# Altium schematic sheet ISL6236A_DEMO.SchDoc
size A3; SheetNumber: 1; SheetTotal: 1
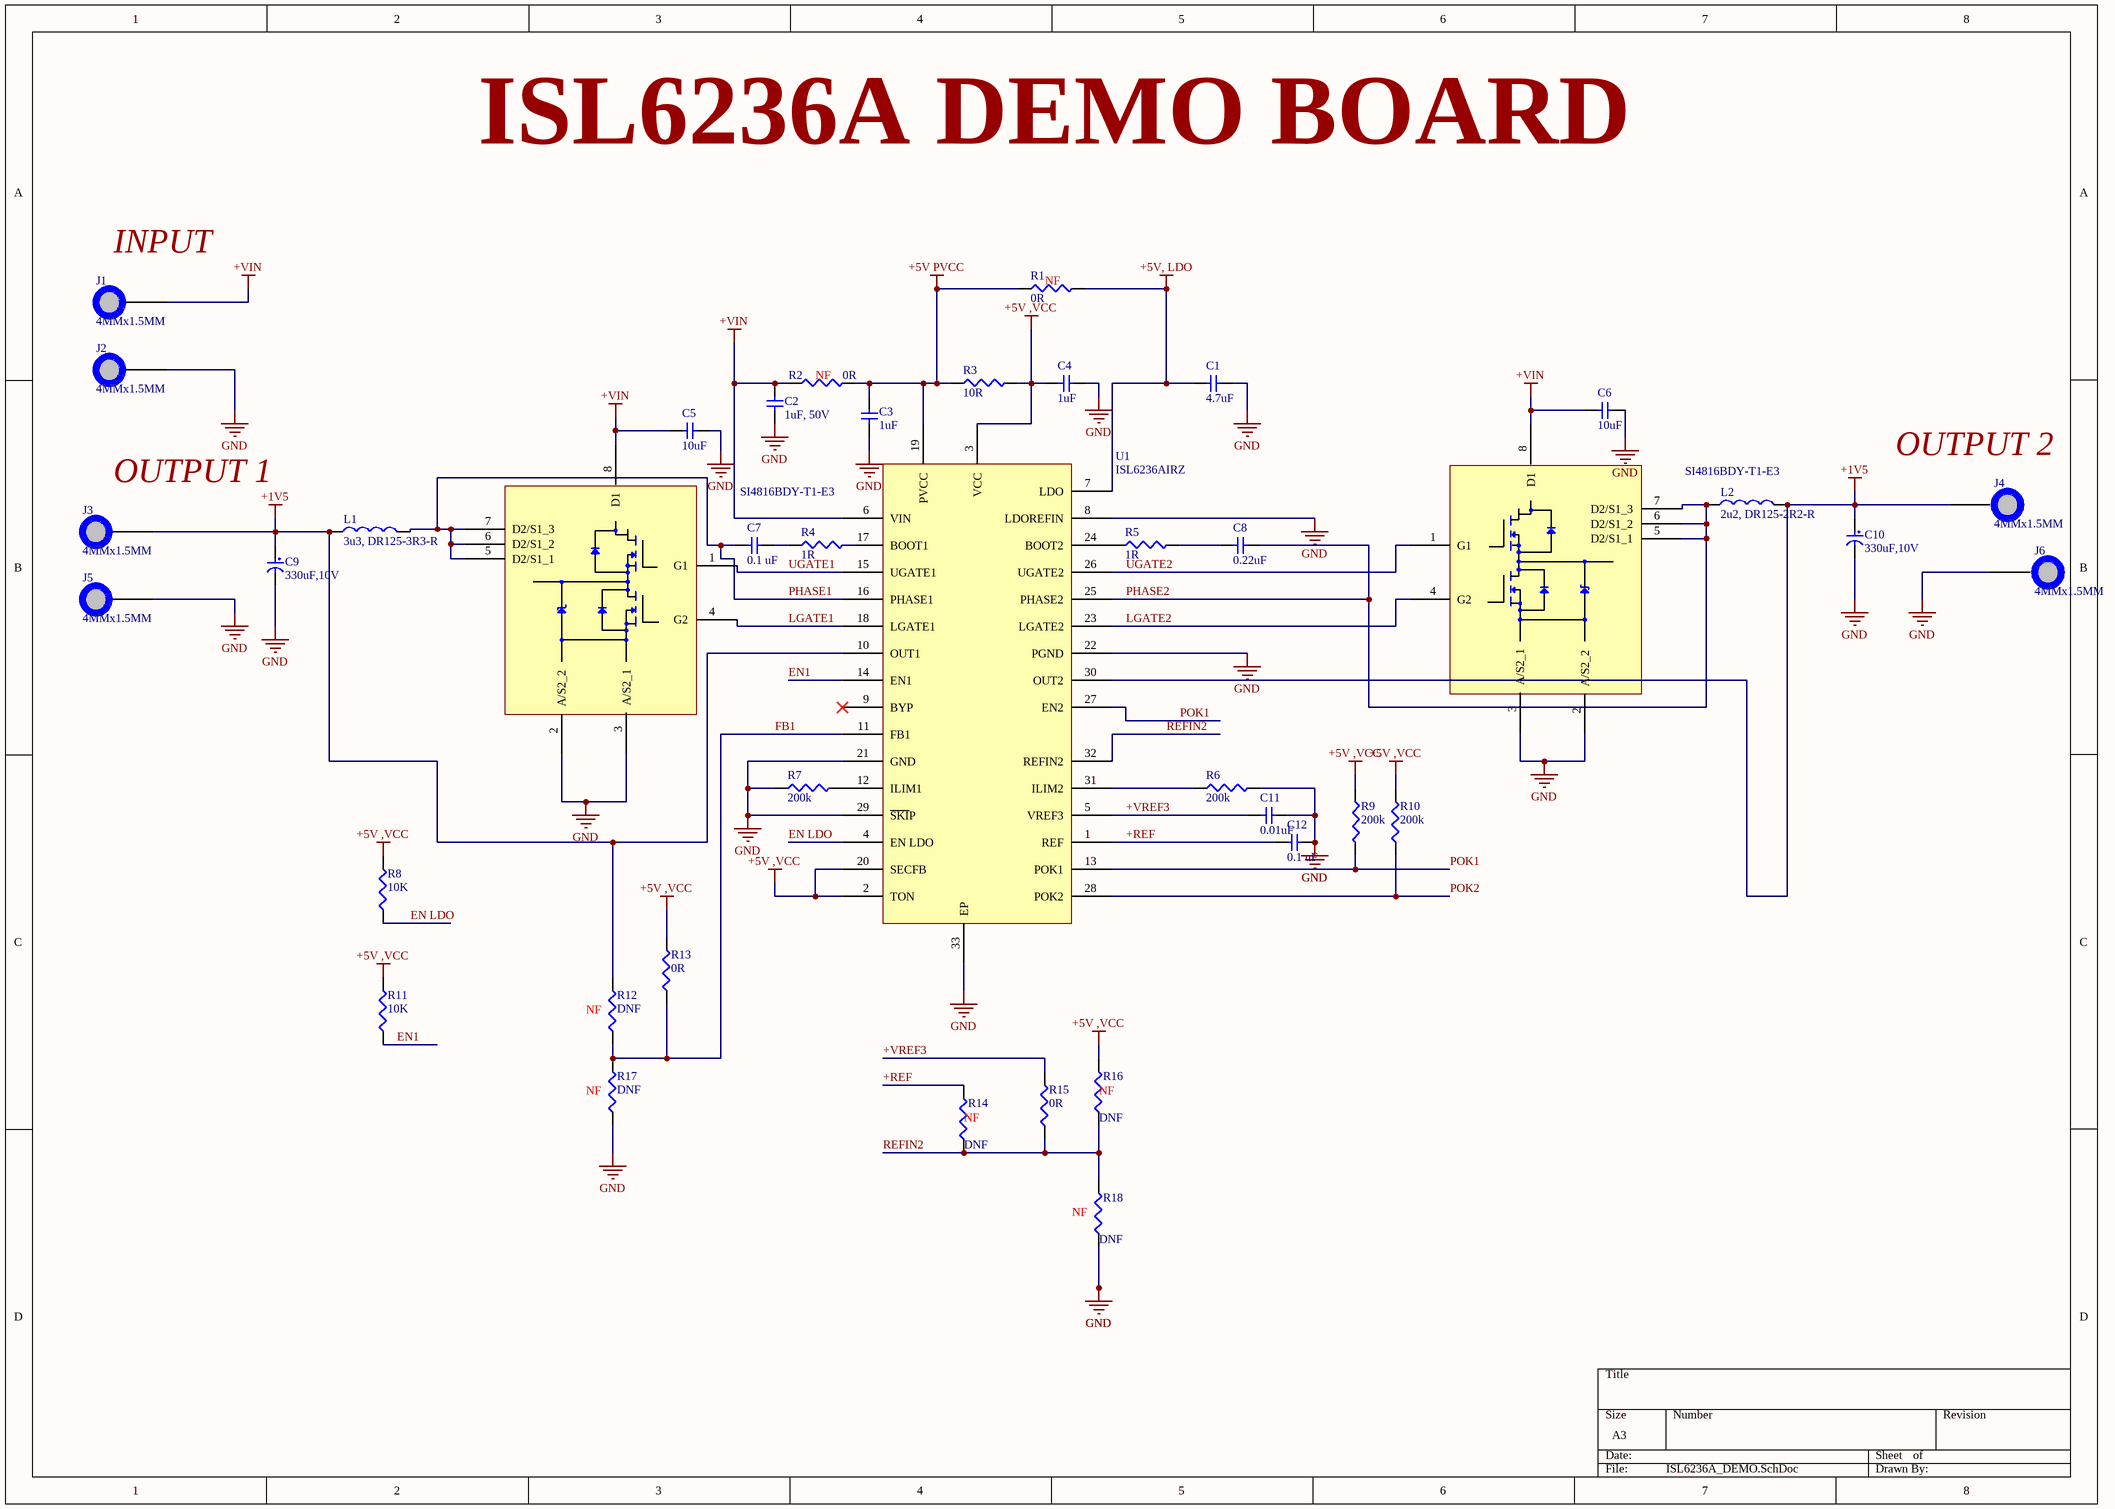
[diagram p0: ISL6236A_DEMO.SchDoc]

## Parts
C1  4.7uF  [C1206]
C2  1uF, 50V  [C0805]
C3  1uF  [C0805]
C4  1uF  [C0805]
C5  10uF  [C1210]
C6  10uF  [C1210]
C7  0.1 uF  [C0805]
C8  0.22uF  [C0805]
C9  330uF,10V  [7343-43]
C10  330uF,10V  [7343-43]
C11  0.01uF  [C0805]
C12  0.1 uF  [C0805]
J1  4MMx1.5MM  [PAD_WITH_HOLE_4MMx1MM5]
J2  4MMx1.5MM  [PAD_WITH_HOLE_4MMx1MM5]
J3  4MMx1.5MM  [PAD_WITH_HOLE_4MMx1MM5]
J4  4MMx1.5MM  [PAD_WITH_HOLE_4MMx1MM5]
J5  4MMx1.5MM  [PAD_WITH_HOLE_4MMx1MM5]
J6  4MMx1.5MM  [PAD_WITH_HOLE_4MMx1MM5]
L1  3u3, DR125-3R3-R  [DR125]
L2  2u2, DR125-2R2-R  [DR125]
Q1  SI4816BDY-T1-E3  [SO-8]
Q2  SI4816BDY-T1-E3  [SO-8]
R1  0R  [R0805]
R2  0R  [R0805]
R3  10R  [R0805]
R4  1R  [R0805]
R5  1R  [R0805]
R6  200k  [R0805]
R7  200k  [R0805]
R8  10K  [R0805]
R9  200k  [R0805]
R10  200k  [R0805]
R11  10K  [R0805]
R12  DNF  [R0805]
R13  0R  [R0805]
R14  DNF  [R0805]
R15  0R  [R0805]
R16  DNF  [R0805]
R17  DNF  [R0805]
R18  DNF  [R0805]
U1  ISL6236AIRZ  [L32.5x5B]

## Nets
+1V5: C9.1 C10.1 J3.1 J4.1 L1.1 L2.2 R12.2 U1.10(OUT1) U1.30(OUT2)
+5V ,VCC: C4.1 R3.2 R8.2 R9.1 R10.2 R11.2 R13.2 R16.2 U1.2(TON) U1.3(VCC) U1.20(SECFB)
+5V PVCC: C3.2 R1.1 R2.2 R3.1 U1.19(PVCC)
+5V, LDO: C1.1 R1.2 U1.7(LDO)
+VIN: C2.1 C5.2 C6.2 J1.1 Q1.8(D1) Q2.8(D1) R2.1 U1.6(VIN)
GND: C1.2 C2.2 C3.1 C4.2 C5.1 C6.1 C9.2 C10.2 C11.2 C12.2 J2.1 J5.1 J6.1 Q1.2(A/S2_2) Q1.3(A/S2_1) Q2.2(A/S2_2) Q2.3(A/S2_1) R6.2 R7.1 R17.1 R18.1 U1.8(LDOREFIN) U1.21(GND) U1.22(PGND) U1.29(~{SKI}P) U1.33(EP)
+REF: C12.1 R14.2 U1.1(REF)
+VREF3: C11.1 R15.2 U1.5(VREF3)
EN1: R11.1 U1.14(EN1)
EN LDO: R8.1 U1.4(EN_LDO)
FB1: R12.1 R13.1 R17.2 U1.11(FB1)
LGATE1: Q1.4(G2) U1.18(LGATE1)
LGATE2: Q2.4(G2) U1.23(LGATE2)
PHASE1: C7.1 L1.2 Q1.5(D2/S1_1) Q1.6(D2/S1_2) Q1.7(D2/S1_3) U1.16(PHASE1)
PHASE2: C8.2 L2.1 Q2.5(D2/S1_1) Q2.6(D2/S1_2) Q2.7(D2/S1_3) U1.25(PHASE2)
POK1: R9.2 U1.13(POK1) U1.27(EN2)
POK2: R10.1 U1.28(POK2)
REFIN2: R14.1 R15.1 R16.1 R18.2 U1.32(REFIN2)
UGATE1: Q1.1(G1) U1.15(UGATE1)
UGATE2: Q2.1(G1) U1.26(UGATE2)
NetC7_2: C7.2 R4.1
NetC8_1: C8.1 R5.2
NetR4_2: R4.2 U1.17(BOOT1)
NetR5_1: R5.1 U1.24(BOOT2)
NetR6_1: R6.1 U1.31(ILIM2)
NetR7_2: R7.2 U1.12(ILIM1)

Not connected (* = marked no-connect by the designer): U1 9(BYP)*

## Notes on the sheet
- ISL6236A DEMO BOARD
- (near J1) INPUT
- (near R1) NF
- (near R2) NF
- (near J3) OUTPUT 1
- (near J4) OUTPUT 2
- (near R12) NF
- (near R17) NF
- (near R14) NF
- (near R16) NF
- (near R18) NF

## Library data of the parts
C1 = C3216X5R1H475K160AB: C Series 1206 4.7 uF 50 V ±10 % Tolerance X5R SMT Multilayer Ceramic Capacitor; Manufacturer: TDK; Supplier: Digi-Key; Supplier Part Number: 445-5994-2-ND; Manufacturer Part Number: C3216X5R1H475K160AB; RoHS: Yes; Category: Ceramic Capacitors; Stock: 64000; Pricing: 2000=0,22725, 4000=0,2121, 10000=0,20453, 14000=0,2015, 50000=0,19316 (USD); ComponentLink1URL: https://datasheet.ciiva.com/24216/c3216x5r1h475k160ab-265269-24216325.pdf?src-supplier=Mouser; ComponentLink1Description: https://datasheet.ciiva.com/24216/c3216x5r1h475k160ab-265269-24216325.pdf?src-supplier=Mouser; ComponentLink2URL: https://datasheet.ciiva.com/6286/tdkmlcccaprange-6286230.pdf?src-supplier=Digi-Key; ComponentLink2Description: https://datasheet.ciiva.com/6286/tdkmlcccaprange-6286230.pdf?src-supplier=Digi-Key; ComponentLink3URL: https://datasheet.ciiva.com/6286/tdkmlcccaprange-6286233.pdf?src-supplier=Digi-Key; ComponentLink3Description: https://datasheet.ciiva.com/6286/tdkmlcccaprange-6286233.pdf?src-supplier=Digi-Key; ComponentLink4URL: https://datasheet.ciiva.com/6286/tdkmlcccaprange-6286236.pdf?src-supplier=Digi-Key; ComponentLink4Description: https://datasheet.ciiva.com/6286/tdkmlcccaprange-6286236.pdf?src-supplier=Digi-Key
C2 = C0805X105K5RACAUTO: Ceramic Capacitor, Multilayer, Ceramic, 50V, 10% +Tol, 10% -Tol, X7R, 15% TC, 1uF, Surface Mount, 0805; Manufacturer: KEMET; Supplier: Digi-Key; Supplier Part Number: 399-C0805X105K5RACAUTOCT-ND; Manufacturer Part Number: C0805X105K5RACAUTO; RoHS: No; Category: Ceramic Capacitors; Stock: 697; Pricing: 1=0,97, 10=0,736, 50=0,6118, 100=0,5268, 500=0,4078, 1000=0,35117 (USD)
C3 C4 = 08053D105KAT2A\3K: Cap Cer 1UF 25V X5R 0805; Manufacturer: Kyocera AVX; Supplier: Digi-Key; Supplier Part Number: 478-KGM21AR51E105KUCT-ND; RoHS: No; Category: Ceramic Capacitors; Stock: 27624; Pricing: 1=0,41, 10=0,288, 50=0,2016, 100=0,1728, 500=0,1296, 1000=0,10944 (USD); Manufacturer Part Number: 08053D105KAT2A\3K
C5 C6 = C1210C106K5PAC7210: Cap Ceramic 10uF 50V X5R 10% Pad SMD 1210 85C T/R; Manufacturer: KEMET; Supplier: Digi-Key; Supplier Part Number: 399-C1210C106K5PAC7210CT-ND; Manufacturer Part Number: C1210C106K5PAC7210; RoHS: Yes; Category: Ceramic Capacitors; Stock: 38264; Pricing: 1=0,9, 10=0,686, 50=0,5702, 100=0,491, 500=0,38016, 1000=0,32736 (USD)
C7 C12 = C0805C104K5RAC7800: Multilayer Ceramic Capacitor, 0.1 uF, 50 V, ± 10%, X7R, 0805 [2012 Metric]; Manufacturer: KEMET; Supplier: Digi-Key; Supplier Part Number: 399-C0805C104K5RAC7800DKR-ND; RoHS: No; Stock: 2423632; Pricing: 1=0,13, 10=0,092, 50=0,052, 100=0,0431, 500=0,03024, 1000=0,02504 (USD); ComponentLink1URL: https://datasheet.octopart.com/C0805C104K5RACTU-KEMET-datasheet-101576148.pdf?src-supplier=Farnell; ComponentLink1Description: https://datasheet.octopart.com/C0805C104K5RACTU-KEMET-datasheet-101576148.pdf?src-supplier=Farnell; ComponentLink2URL: https://datasheet.octopart.com/C0805C104K5RAC-TU-Kemet-datasheet-32036385.pdf?src-supplier=Element14; ComponentLink2Description: https://datasheet.octopart.com/C0805C104K5RAC-TU-Kemet-datasheet-32036385.pdf?src-supplier=Element14; ComponentLink3URL: https://datasheet.octopart.com/C0805C104K5RAC-TU-Kemet-datasheet-5313890.pdf?src-supplier=Newark; ComponentLink3Description: https://datasheet.octopart.com/C0805C104K5RAC-TU-Kemet-datasheet-5313890.pdf?src-supplier=Newark; ComponentLink4URL: https://datasheet.octopart.com/C0805C104K5RACTU-KEMET-datasheet-164512540.pdf?src-supplier=TME; ComponentLink4Description: https://datasheet.octopart.com/C0805C104K5RACTU-KEMET-datasheet-164512540.pdf?src-supplier=TME; Manufacturer Part Number: C0805C104K5RAC7800
C8 = C0805C224K5RACTU: Multilayer Ceramic Capacitor, 0.22 uF, 50 V, ± 10%, X7R, 0805 [2012 Metric]; Manufacturer: KEMET; Value: 220nF; Voltage Rating: 50V; Dissipation Factor: 2.5%; Supplier: Digi-Key; Supplier Part Number: 399-C0805C224K5RACTUCT-ND; Manufacturer Part Number: C0805C224K5RACTU; RoHS: Yes; Category: Ceramic Capacitors; Stock: 1003081; Pricing: 1=0,15, 10=0,106, 50=0,06, 100=0,0497, 500=0,03484, 1000=0,02885 (USD); Mounting Technology: Surface Mount,PCB; Case/Package: 0805; Case Code (Metric): 2012; Case Code (Imperial): 0805; Dielectric Material: Ceramic; Min Operating Temperature: -55°C; Max Operating Temperature: 125°C; Package Quantity: 4000; Tolerance: 10%; Packaging: Tape and Reel; Voltage Rating (DC): 50V; Dielectric: X7R; Termination: SMD/SMT; Voltage: 50V; Series: SMD Comm X7R; Construction: Flat; Length: 2mm; Width: 1.2mm; Height: 1.1mm; Lead Pitch: 0.75mm; Depth: 1.25mm; Radiation Hardening: No; Reach SVHC Compliant: No; RoHS Compliant: Yes; ComponentLink1URL: https://datasheet.ciiva.com/7842/kem-c1002-x7r-smd-7842582.pdf?src-supplier=Element14; ComponentLink1Description: https://datasheet.ciiva.com/7842/kem-c1002-x7r-smd-7842582.pdf?src-supplier=Element14; ComponentLink2URL: https://datasheet.ciiva.com/28682/1851736-28682316.pdf?src-supplier=Element14; ComponentLink2Description: https://datasheet.ciiva.com/28682/1851736-28682316.pdf?src-supplier=Element14; ComponentLink3URL: https://datasheet.ciiva.com/14589/70095383-14589519.pdf?src-supplier=Allied+Electronics; ComponentLink3Description: https://datasheet.ciiva.com/14589/70095383-14589519.pdf?src-supplier=Allied+Electronics; ComponentLink4URL: https://datasheet.ciiva.com/14603/70095383-14603247.pdf?src-supplier=Allied+Electronics; ComponentLink4Description: https://datasheet.ciiva.com/14603/70095383-14603247.pdf?src-supplier=Allied+Electronics
C9 C10 = T530X337M010ATE004: Cap Tant Solid 330uF 10V X CASE 20% (7.3 X 4.3 X 4mm) SMD 7343-43 0.004 Ohm 125 C T/R; Manufacturer: KEMET; Supplier: Digi-Key; Supplier Part Number: 399-10378-1-ND; Manufacturer Part Number: T530X337M010ATE004; RoHS: Yes; Category: Polymer Capacitors; Stock: 3821; Pricing: 1=7,14, 10=6,35, 50=5,5562, 100=5,0799 (USD); ComponentLink1URL: https://datasheet.ciiva.com/11794/0900766b80deaa91-11794477.pdf?src-supplier=Rs; ComponentLink1Description: https://datasheet.ciiva.com/11794/0900766b80deaa91-11794477.pdf?src-supplier=Rs; ComponentLink2URL: https://datasheet.ciiva.com/14593/70096008-14593753.pdf?src-supplier=Allied+Electronics; ComponentLink2Description: https://datasheet.ciiva.com/14593/70096008-14593753.pdf?src-supplier=Allied+Electronics
C11 = C0805F103K5RACTU: 0805 C 10nF Ceramic Multilayer Capacitor; 50 VDC; +125degC; X7R Dielec; +/-10%; Manufacturer: KEMET; Voltage Rating: 50V; Tolerance: 10%; Supplier: Digi-Key; Supplier Part Number: 399-C0805F103K5RAC7800CT-ND; Manufacturer Part Number: C0805F103K5RACTU; RoHS: Yes; Category: Ceramic Capacitors; Stock: 11337; Pricing: 1=0,33, 10=0,225, 50=0,1502, 100=0,1276, 500=0,09008, 1000=0,07883 (USD); Mounting Technology: Surface Mount; Case/Package: 0805; Pins: 2; Case Code (Imperial): 0805; Case Code (Metric): 2012; Min Operating Temperature: -55°C; Max Operating Temperature: 125°C; Value: 10nF; Package Quantity: 1; Voltage Rating (DC): 50V; Packaging: Cut Tape; Dielectric: X7R; Termination: SMD/SMT; Series: FO-CAP; Construction: Flat; Length: 2mm; Width: 0.049inch; Height: 0.9mm; Lead Pitch: 0.75mm; Thickness: 0.039inch; Depth: 1.25mm; Reach SVHC Compliant: No; RoHS Compliant: Yes; ComponentLink1URL: https://datasheet.ciiva.com/146/docfinderpartnumber-c0805f103k5ractu-146278.pdf?src-supplier=Digi-Key; ComponentLink1Description: https://datasheet.ciiva.com/146/docfinderpartnumber-c0805f103k5ractu-146278.pdf?src-supplier=Digi-Key; ComponentLink2URL: https://datasheet.ciiva.com/7842/48829-7842407.pdf?src-supplier=Element14; ComponentLink2Description: https://datasheet.ciiva.com/7842/48829-7842407.pdf?src-supplier=Element14; ComponentLink3URL: https://datasheet.ciiva.com/7842/48829-7842408.pdf?src-supplier=Element14; ComponentLink3Description: https://datasheet.ciiva.com/7842/48829-7842408.pdf?src-supplier=Element14
J1-J6 = PAD_WITH_HOLE_4MMx1MM5: Pad with a hole 4mmx1.5mm
L1 = DR125-3R3-R: Inductor Power Shielded Drum Core 3.3uH 20% 100KHz Ferrite 9.26A 6.3mOhm DCR T/R; Manufacturer: Eaton Cooper; Supplier: Digi-Key; Supplier Part Number: 513-1529-2-ND; Manufacturer Part Number: DR125-3R3-R; RoHS: Yes; Category: Fixed Inductors; Stock: 28200; Pricing: 600=0,63625, 1200=0,56555, 3000=0,54788, 6000=0,53021, 15000=0,51253 (USD)
L2 = DR125-2R2-R: Ind Power Shielded Wirewound 2.2uH 20% 100KHz Ferrite 10.9A T/R; Manufacturer: Eaton Cooper; Supplier: Digi-Key; Supplier Part Number: 513-1662-2-ND; Manufacturer Part Number: DR125-2R2-R; RoHS: Yes; Category: Fixed Inductors; Stock: 1800; Pricing: 600=0,6363, 1200=0,5656, 3000=0,54793, 6000=0,53025, 15000=0,51257 (USD); ComponentLink1URL: https://datasheet.ciiva.com/14667/0900766b8116a153-14667792.pdf?src-supplier=Rs; ComponentLink1Description: https://datasheet.ciiva.com/14667/0900766b8116a153-14667792.pdf?src-supplier=Rs; ComponentLink2URL: https://datasheet.ciiva.com/26926/getdatasheetpartid-571249-26926912.pdf?src-supplier=Verical; ComponentLink2Description: https://datasheet.ciiva.com/26926/getdatasheetpartid-571249-26926912.pdf?src-supplier=Verical; ComponentLink3URL: https://datasheet.ciiva.com/8004/87246-8004874.pdf?src-supplier=Element14; ComponentLink3Description: https://datasheet.ciiva.com/8004/87246-8004874.pdf?src-supplier=Element14
Q1 Q2 = SI4816BDY-T1-E3: Trans Mosfet N-ch 30V 5.8A/8.2A 8-PIN SOIC N T/r; Manufacturer: Vishay Siliconix; Supplier: Digi-Key; Supplier Part Number: SI4816BDY-T1-E3CT-ND; RoHS: Yes; Category: MOSFETs; Pricing: 1=1,58, 10=1,419, 100=1,1402, 500=0,93678, 1000=0,77618 (USD); ComponentLink1URL: https://datasheet.ciiva.com/15137/getdatasheetpartid-99188-15137841.pdf?src-supplier=Verical; ComponentLink1Description: https://datasheet.ciiva.com/15137/getdatasheetpartid-99188-15137841.pdf?src-supplier=Verical; ComponentLink2URL: https://datasheet.ciiva.com/7710/si4816bd-7710449.pdf?src-supplier=Element14; ComponentLink2Description: https://datasheet.ciiva.com/7710/si4816bd-7710449.pdf?src-supplier=Element14; ComponentLink3URL: https://datasheet.ciiva.com/928/si4816bd-928458.pdf?src-supplier=Digi-Key; ComponentLink3Description: https://datasheet.ciiva.com/928/si4816bd-928458.pdf?src-supplier=Digi-Key; ComponentLink4URL: https://datasheet.ciiva.com/928/si4816bd-928459.pdf?src-supplier=Digi-Key; ComponentLink4Description: https://datasheet.ciiva.com/928/si4816bd-928459.pdf?src-supplier=Digi-Key; ComponentLink5URL: https://datasheet.ciiva.com/928/si4816bd-928460.pdf?src-supplier=Digi-Key; ComponentLink5Description: https://datasheet.ciiva.com/928/si4816bd-928460.pdf?src-supplier=Digi-Key; ComponentLink6URL: https://datasheet.ciiva.com/11161/si4816bd-11161496.pdf?src-supplier=Avnet; ComponentLink6Description: https://datasheet.ciiva.com/11161/si4816bd-11161496.pdf?src-supplier=Avnet; ComponentLink7URL: https://datasheet.ciiva.com/16486/si4816bd-16486349.pdf?src-supplier=Future+Electronics; ComponentLink7Description: https://datasheet.ciiva.com/16486/si4816bd-16486349.pdf?src-supplier=Future+Electronics; ComponentLink8URL: https://datasheet.ciiva.com/18448/70026226-18448822.pdf?src-supplier=Allied+Electronics; ComponentLink8Description: https://datasheet.ciiva.com/18448/70026226-18448822.pdf?src-supplier=Allied+Electronics; Manufacturer Part Number: SI4816BDY-T1-E3
R1 R2 R13 R15 = AC0805JR-070RL: Fixed Resistor, Metal Glaze/thick Film, 0.125W, 0ohm, Surface Mount, 0805; Manufacturer: Yageo; Power Rating: 125mW; Tolerance: 5%; Voltage Rating: 150V; Temperature Coefficient: 200ppm/°C; Supplier: Digi-Key; Supplier Part Number: YAG3755CT-ND; Manufacturer Part Number: AC0805JR-070RL; RoHS: Yes; Category: Chip SMD Resistors; Stock: 181915; Pricing: 1=0,1, 10=0,037, 25=0,0272, 50=0,0206, 100=0,0152, 250=0,0116, 500=0,00928, 1000=0,00683 (USD); Case/Package: 0805; Case Code (Imperial): 0805; Case Code (Metric): 2012; Min Operating Temperature: -55°C; Max Operating Temperature: 155°C; Packaging: Tape and Reel; Value: 0R; Termination: SMD/SMT; Number of Terminations: 2; Max Power Dissipation: 125mW; Features: Moisture Resistant,Automotive AEC-Q200; Series: AC; Length: 0.079inch; Width: 1.25mm; Height: 0.024inch; Lead Free: Lead Free; RoHS Compliant: Yes; ComponentLink1URL: https://datasheet.octopart.com/AC0805JR-070RL-Yageo-datasheet-166720450.pdf?src-supplier=Future+Electronics; ComponentLink1Description: https://datasheet.octopart.com/AC0805JR-070RL-Yageo-datasheet-166720450.pdf?src-supplier=Future+Electronics; ComponentLink2URL: http://www.yageo.com/documents/recent/PYu-AC_51_RoHS_L_2.pdf?src-supplier=Mouser; ComponentLink2Description: http://www.yageo.com/documents/recent/PYu-AC_51_RoHS_L_2.pdf?src-supplier=Mouser
R3 = AC0805FR-0710RL: Res Thick Film 0805 10 Ohm 1% 0.125W(1/8W) ±200ppm/C Pad SMD Automotive T/R; Manufacturer: Yageo; Supplier: Digi-Key; Supplier Part Number: YAG3690CT-ND; Manufacturer Part Number: AC0805FR-0710RL; RoHS: Yes; Category: Chip SMD Resistors; Stock: 256584; Pricing: 1=0,1, 10=0,049, 50=0,032, 100=0,0272, 500=0,01914, 1000=0,01668 (USD); ComponentLink1URL: http://www.mouser.com/ds/2/447/yageodocoutput-1111992.pdf?src-supplier=Mouser; ComponentLink1Description: http://www.mouser.com/ds/2/447/yageodocoutput-1111992.pdf?src-supplier=Mouser; ComponentLink2URL: http://www.yageo.com/NewPortal/yageodocoutput?fileName=/pdf/R-Chip/PYu-AC_51_RoHS_L_6.pdf&src-supplier=Digi-Key; ComponentLink2Description: http://www.yageo.com/NewPortal/yageodocoutput?fileName=/pdf/R-Chip/PYu-AC_51_RoHS_L_6.pdf&src-supplier=Digi-Key; ComponentLink3URL: https://www.yageo.com/upload/media/product/productsearch/datasheet/rchip/PYu-AC_51_RoHS_L_7.pdf?src-supplier=Digi-Key; ComponentLink3Description: https://www.yageo.com/upload/media/product/productsearch/datasheet/rchip/PYu-AC_51_RoHS_L_7.pdf?src-supplier=Digi-Key
R4 R5 = AC0805FR-071RL: Res Thick Film 0805 1 Ohm 1% 0.125W(1/8W) ±200ppm/C Pad SMD Automotive T/R; Manufacturer: Yageo; Supplier: Digi-Key; Supplier Part Number: YAG3705CT-ND; Manufacturer Part Number: AC0805FR-071RL; RoHS: Yes; Category: Chip SMD Resistors; Stock: 82542; Pricing: 1=0,1, 10=0,049, 50=0,032, 100=0,0272, 500=0,01914, 1000=0,01668 (USD); ComponentLink1URL: https://datasheet.ciiva.com/12576/pyu-ac-51-rohs-l-2-12576553.pdf?src-supplier=Mouser; ComponentLink1Description: https://datasheet.ciiva.com/12576/pyu-ac-51-rohs-l-2-12576553.pdf?src-supplier=Mouser
R6 R7 R9 R10 = AC0805FR-07200KL: Res Thick Film 0805 200K Ohm 1% 0.125W(1/8W) ±100ppm/C Pad SMD Automotive T/R; Manufacturer: Yageo; Supplier: Digi-Key; Supplier Part Number: YAG3706CT-ND; Manufacturer Part Number: AC0805FR-07200KL; RoHS: Yes; Category: Chip SMD Resistors; Stock: 10502; Pricing: 1=0,1, 10=0,029, 50=0,0188, 100=0,0158, 500=0,01096, 1000=0,00948 (USD); ComponentLink1URL: http://www.mouser.com/ds/2/447/yageodocoutput-1111992.pdf?src-supplier=Mouser; ComponentLink1Description: http://www.mouser.com/ds/2/447/yageodocoutput-1111992.pdf?src-supplier=Mouser; ComponentLink2URL: http://www.yageo.com/NewPortal/yageodocoutput?fileName=/pdf/R-Chip/PYu-AC_51_RoHS_L_6.pdf&src-supplier=Digi-Key; ComponentLink2Description: http://www.yageo.com/NewPortal/yageodocoutput?fileName=/pdf/R-Chip/PYu-AC_51_RoHS_L_6.pdf&src-supplier=Digi-Key; ComponentLink3URL: http://www.yageo.com/documents/recent/PYu-AC_51_RoHS_L_2.pdf?src-supplier=Future+Electronics; ComponentLink3Description: http://www.yageo.com/documents/recent/PYu-AC_51_RoHS_L_2.pdf?src-supplier=Future+Electronics; ComponentLink4URL: https://datasheet.octopart.com/AC0805FR-07200KL-Yageo-datasheet-151884373.pdf?src-supplier=Future+Electronics; ComponentLink4Description: https://datasheet.octopart.com/AC0805FR-07200KL-Yageo-datasheet-151884373.pdf?src-supplier=Future+Electronics
R8 R11 = AC0805FR-0710KL: Res Thick Film 0805 10K Ohm 1% 0.125W(1/8W) ±100ppm/C Pad SMD Automotive T/R; Manufacturer: Yageo; Supplier: Digi-Key; Supplier Part Number: 311-10KLGCT-ND; Manufacturer Part Number: AC0805FR-0710KL; RoHS: Yes; Category: Chip SMD Resistors; Stock: 575627; Pricing: 1=0,1, 10=0,029, 50=0,0188, 100=0,0158, 500=0,01096, 1000=0,00948 (USD); ComponentLink1URL: https://datasheet.ciiva.com/5558/pyu-ac-51-rohs-l-2-5558347.pdf?src-supplier=Mouser; ComponentLink1Description: https://datasheet.ciiva.com/5558/pyu-ac-51-rohs-l-2-5558347.pdf?src-supplier=Mouser
R12 R14 R16-R18 = RES
U1 = ISL6236AIRZ: Soft Sw PWM Cntrlr 2-OUT Power Supply Controller 200KHz/300KHz/400KHz/500KHz 32-Pin QFN EP; Manufacturer: Renesas; Supplier: Digi-Key; Manufacturer Part Number: ISL6236AIRZ; RoHS: Yes; Stock: 723; Pricing: 1=6,69, 10=6,039, 25=5,7584, 100=5, 250=4,77528, 500=4,4255 (USD); ComponentLink1URL: https://datasheet.octopart.com/ISL6236AIRZ-Renesas-datasheet-138160199.pdf?src-supplier=Future+Electronics; ComponentLink1Description: https://datasheet.octopart.com/ISL6236AIRZ-Renesas-datasheet-138160199.pdf?src-supplier=Future+Electronics; ComponentLink2URL: http://www.intersil.com/content/dam/Intersil/documents/isl6/isl6236a.pdf?src-supplier=Digi-Key; ComponentLink2Description: http://www.intersil.com/content/dam/Intersil/documents/isl6/isl6236a.pdf?src-supplier=Digi-Key; Supplier Part Number: ISL6236AIRZ-ND